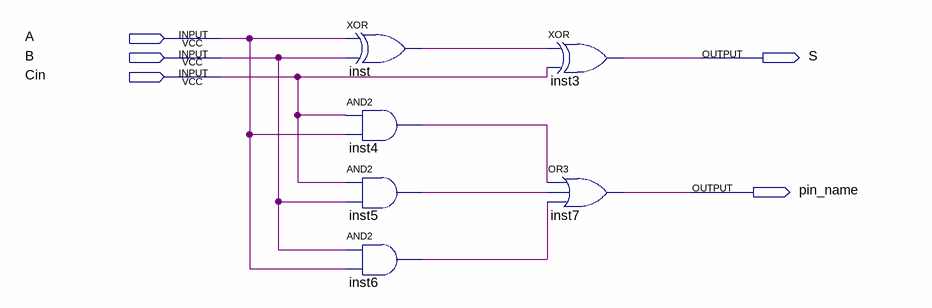
[diagram p0: schematic sheet]
// Quartus schematic Monitoria.bdf as structural Verilog: 6 symbols, 5 pins
module Monitoria (
  input  A,
  input  B,
  input  Cin,
  output S,
  output pin_name
);

  wire inst4_out, inst5_out, inst6_out, inst_out;

  xor inst (inst_out, A, B);
  and inst4 (inst4_out, Cin, A);
  and inst5 (inst5_out, Cin, B);
  and inst6 (inst6_out, B, A);
  xor inst3 (S, inst_out, Cin);
  or inst7 (pin_name, inst4_out, inst5_out, inst6_out);
endmodule
